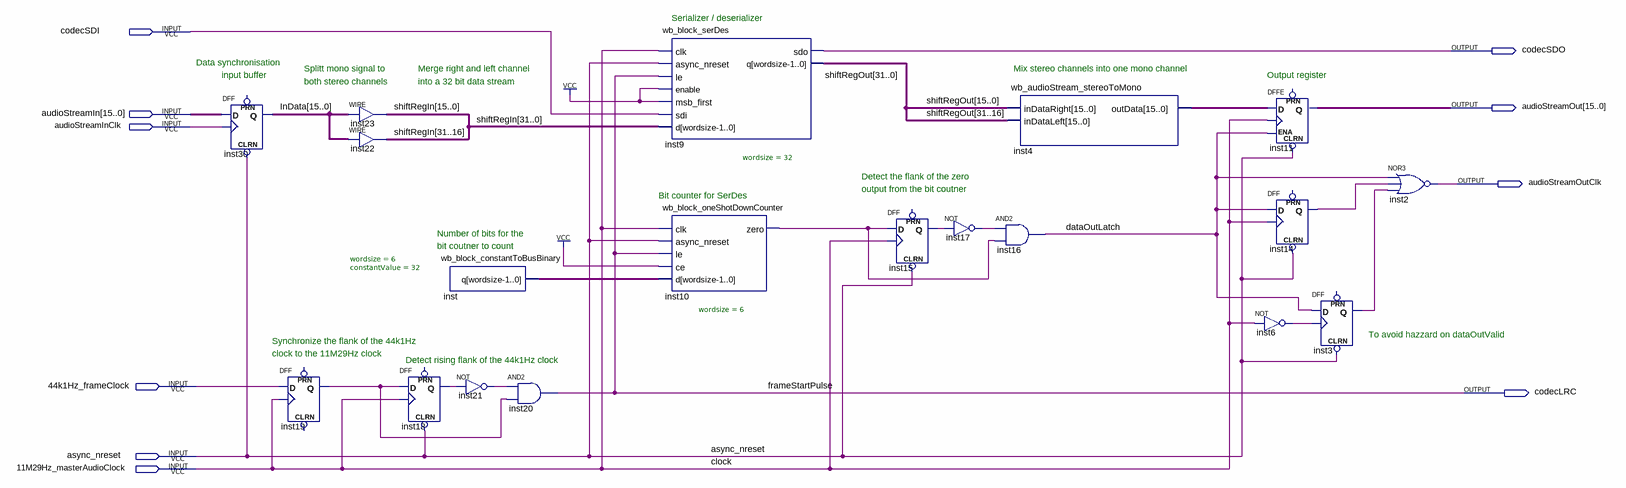
[diagram p0: schematic sheet]
// Quartus schematic wb_audioStream_Interface.bdf as structural Verilog: 19 symbols, 10 pins
module wb_audioStream_Interface (
  input  codecSDI,
  input  [15:0] audioStreamIn,
  input  audioStreamInClk,
  input  \44k1Hz_frameClock ,
  input  async_nreset,
  input  \11M29Hz_masterAudioClock ,
  output codecSDO,
  output [15:0] audioStreamOut,
  output audioStreamOutClk,
  output codecLRC
);

  wire dataOutLatch, inst3_q, inst6_out, inst10_zero, inst14_q, inst15_q, inst17_out, inst18_q, inst19_q,
       inst21_out;
  wire [5:0] inst_q;
  wire [15:0] InData, inst4_outdata;
  wire [31:0] shiftRegIn, shiftRegOut;

  DFF inst30[15:0] (.CLRN(async_nreset), .CLK(audioStreamInClk), .D(audioStreamIn), .Q(InData));  // open: PRN
  DFF inst19 (.CLK(\11M29Hz_masterAudioClock ), .D(\44k1Hz_frameClock ), .Q(inst19_q));  // open: CLRN, PRN
  assign shiftRegIn[15:0] = InData;  // WIRE inst23
  assign shiftRegIn[31:16] = InData;  // WIRE inst22
  DFF inst18 (.CLRN(async_nreset), .CLK(\11M29Hz_masterAudioClock ), .D(inst19_q), .Q(inst18_q));  // open: PRN
  wb_block_constantToBusBinary #(.wordsize(6), .constantValue(32)) inst (.q(inst_q));
  not inst21 (inst21_out, inst18_q);
  and inst20 (codecLRC, inst21_out, inst19_q);
  wb_block_serDes #(.wordsize(32)) inst9 (
    .clk(\11M29Hz_masterAudioClock ), .async_nreset(async_nreset), .le(codecLRC), .enable(1'b1),
    .msb_first(1'b1), .sdi(codecSDI), .d(shiftRegIn), .sdo(codecSDO), .q(shiftRegOut));
  wb_block_oneShotDownCounter #(.wordsize(6)) inst10 (
    .clk(\11M29Hz_masterAudioClock ), .async_nreset(async_nreset), .le(codecLRC), .ce(1'b1), .d(inst_q),
    .zero(inst10_zero));
  DFF inst15 (.CLRN(async_nreset), .CLK(\11M29Hz_masterAudioClock ), .D(inst10_zero), .Q(inst15_q));  // open: PRN
  not inst17 (inst17_out, inst15_q);
  wb_audioStream_stereoToMono inst4 (
    .inDataRight(shiftRegOut[15:0]), .inDataLeft(shiftRegOut[31:16]), .outData(inst4_outdata));
  and inst16 (dataOutLatch, inst17_out, inst10_zero);
  not inst6 (inst6_out, \11M29Hz_masterAudioClock );
  DFFE inst11[15:0] (
    .CLRN(async_nreset), .D(inst4_outdata), .CLK(\11M29Hz_masterAudioClock ), .ENA(dataOutLatch),
    .Q(audioStreamOut));  // open: PRN
  DFF inst14 (.CLRN(async_nreset), .CLK(\11M29Hz_masterAudioClock ), .D(dataOutLatch), .Q(inst14_q));  // open: PRN
  DFF inst3 (.CLRN(async_nreset), .CLK(inst6_out), .D(dataOutLatch), .Q(inst3_q));  // open: PRN
  nor inst2 (audioStreamOutClk, dataOutLatch, inst14_q, inst3_q);

  // Other names for the same wires on the sheet: clock = \11M29Hz_masterAudioClock ; frameStartPulse = codecLRC

  // Notes on the sheet:
  //   Serializer / deserializer
  //   Data synchronisation
  //   Splitt mono signal to
  //   Merge right and left channel
  //   Mix stereo channels into one mono channel
  //   input buffer
  //   Output register
  //   both stereo channels
  //   into a 32 bit data stream
  //   Detect the flank of the zero
  //   output from the bit coutner
  //   Bit counter for SerDes
  //   Number of bits for the
  //   bit coutner to count
  //   To avoid hazzard on dataOutValid
  //   Synchronize the flank of the 44k1Hz
  //   clock to the 11M29Hz clock
  //   Detect rising flank of the 44k1Hz clock
endmodule
